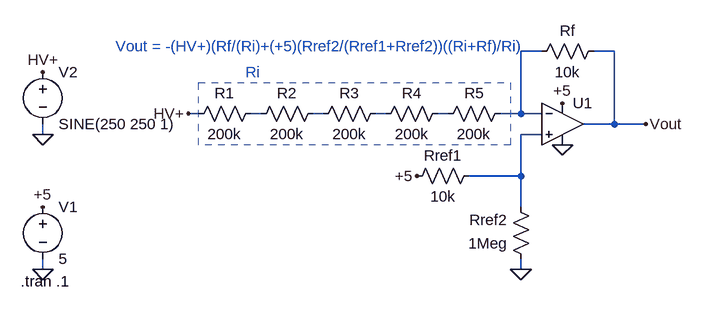
[diagram p0: schematic OpAmpStepDownCircuit.asc]
OpAmpStepDownCircuit.asc, the LTspice schematic file:
Version 4
SHEET 1 880 680
WIRE 544 -16 512 -16
WIRE 656 -16 624 -16
WIRE 16 80 0 80
WIRE 112 80 96 80
WIRE 208 80 192 80
WIRE 304 80 288 80
WIRE 400 80 384 80
WIRE 512 80 512 -16
WIRE 512 80 480 80
WIRE 544 80 512 80
WIRE 656 96 656 -16
WIRE 656 96 608 96
WIRE 704 96 656 96
WIRE -224 112 -224 96
WIRE 544 112 512 112
WIRE 512 176 512 112
WIRE 512 176 432 176
WIRE 512 224 512 176
WIRE -224 320 -224 304
WIRE 512 320 512 304
FLAG -224 224 +5
FLAG -224 320 0
FLAG 576 64 +5
FLAG 704 96 Vout
FLAG 512 320 0
FLAG 352 176 +5
FLAG 576 128 0
FLAG 0 80 HV+
FLAG -224 112 0
FLAG -224 16 HV+
SYMBOL OpAmps\\UniversalOpAmp 576 96 R0
SYMATTR InstName U1
SYMBOL voltage -224 208 R0
WINDOW 123 0 0 Left 0
WINDOW 39 0 0 Left 0
SYMATTR InstName V1
SYMATTR Value 5
SYMBOL res 640 -32 R90
WINDOW 0 0 56 VBottom 2
WINDOW 3 32 56 VTop 2
SYMATTR InstName Rf
SYMATTR Value 10k
SYMBOL res 448 160 R90
WINDOW 0 0 56 VBottom 2
WINDOW 3 32 56 VTop 2
SYMATTR InstName Rref1
SYMATTR Value 10k
SYMBOL res 528 320 R180
WINDOW 0 36 76 Left 2
WINDOW 3 36 40 Left 2
SYMATTR InstName Rref2
SYMATTR Value 1Meg
SYMBOL res 112 64 R90
WINDOW 0 0 56 VBottom 2
WINDOW 3 32 56 VTop 2
SYMATTR InstName R1
SYMATTR Value 200k
SYMBOL res 208 64 R90
WINDOW 0 0 56 VBottom 2
WINDOW 3 32 56 VTop 2
SYMATTR InstName R2
SYMATTR Value 200k
SYMBOL res 304 64 R90
WINDOW 0 0 56 VBottom 2
WINDOW 3 32 56 VTop 2
SYMATTR InstName R3
SYMATTR Value 200k
SYMBOL res 400 64 R90
WINDOW 0 0 56 VBottom 2
WINDOW 3 32 56 VTop 2
SYMATTR InstName R4
SYMATTR Value 200k
SYMBOL res 496 64 R90
WINDOW 0 0 56 VBottom 2
WINDOW 3 32 56 VTop 2
SYMATTR InstName R5
SYMATTR Value 200k
SYMBOL voltage -224 0 R0
WINDOW 123 0 0 Left 0
WINDOW 39 0 0 Left 0
SYMATTR InstName V2
SYMATTR Value SINE(250 250 1)
TEXT -258 338 Left 2 !.tran .1
TEXT -112 -24 Left 2 ;Vout = -(HV+)(Rf/(Ri)+(+5)(Rref2/(Rref1+Rref2))((Ri+Rf)/Ri)
TEXT 88 16 Left 2 ;Ri
RECTANGLE Normal 496 128 16 32 2

The netlist it stands for:
* OpAmpStepDownCircuit.asc
XU1 N006 N001 +5 0 Vout level1 Avol=1Meg GBW=10Meg Vos=0 En=0 Enk=0 In=0 Ink=0 Rin=500Meg  ; pins In+ In- V+ V- OUT
V1 +5 0 5
Rf Vout N001 10k
Rref1 N006 +5 10k
Rref2 0 N006 1Meg
R1 N002 HV+ 200k
R2 N003 N002 200k
R3 N004 N003 200k
R4 N005 N004 200k
R5 N001 N005 200k
V2 HV+ 0 SINE(250 250 1)
.tran .1
* Vout = -(HV+)(Rf/(Ri)+(+5)(Rref2/(Rref1+Rref2))((Ri+Rf)/Ri)
* Ri
.lib UniversalOpAmp1.lib
.backanno
.end